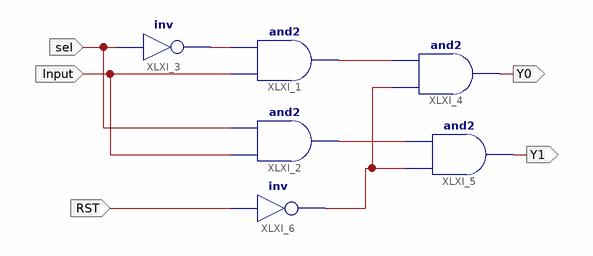
[diagram p0: schematic sheet 1]
// Xilinx ISE schematic demux1to2.sch (artix7) as structural Verilog: 6 symbols, 5 ports
module demux1to2 (
  input  sel,
  input  Input,
  input  RST,
  output Y0,
  output Y1
);

  wire XLXN_2, XLXN_3, XLXN_11, XLXN_12;

  and XLXI_1 (XLXN_11, Input, XLXN_2);
  and XLXI_2 (XLXN_12, Input, sel);
  not XLXI_3 (XLXN_2, sel);
  and XLXI_4 (Y0, XLXN_3, XLXN_11);
  and XLXI_5 (Y1, XLXN_3, XLXN_12);
  not XLXI_6 (XLXN_3, RST);
endmodule
